# Altium schematic sheet MicroSd.SchDoc
size A4; SheetNumber: 2; SheetTotal: 3
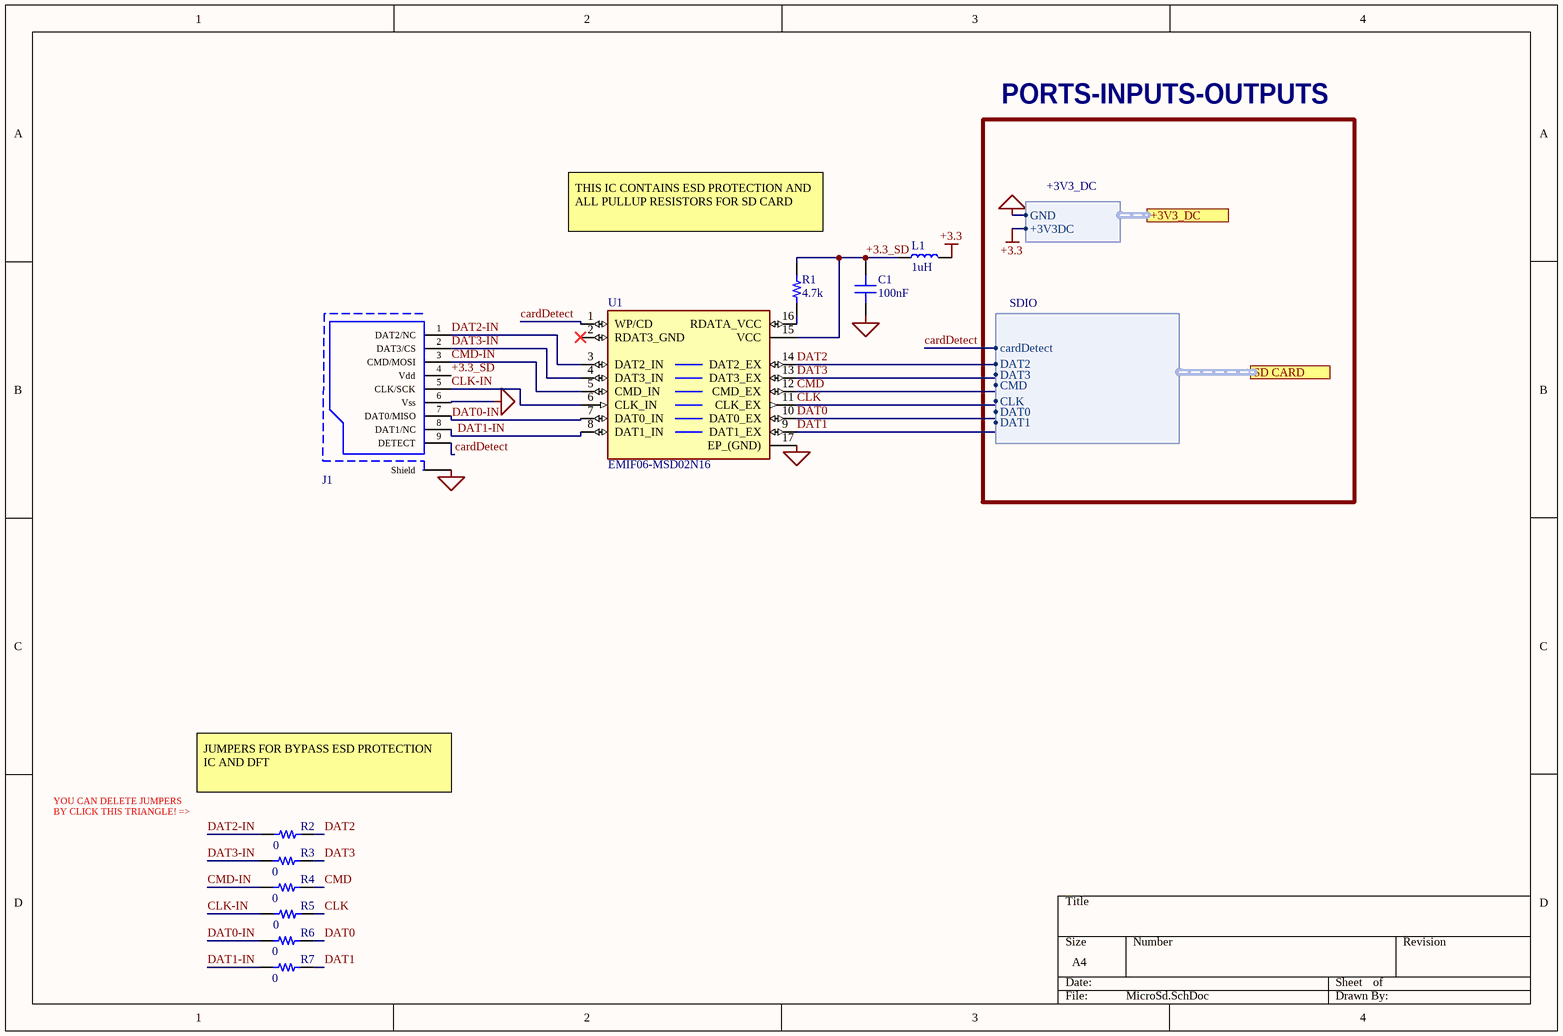
[diagram p0: MicroSd.SchDoc]

## Parts
C1  100nF  [CAP 0603_1608]
J1  Micro SD  [TFP-09-2-12B]  (value not drawn)
L1  1uH  [IND 0805_2012]
R1  4.7k  [RES 0603_1608]
R2  0  [RES 0805_2012]
R3  0  [RES 0805_2012]
R4  0  [RES 0805_2012]
R5  0  [RES 0805_2012]
R6  0  [RES 0805_2012]
R7  0  [RES 0805_2012]
U1  EMIF06-MSD02N16  [EMIF06MSD02N16]

## Ports
+3V3_DC (harness +3V3_DC, see Main[2B]), SD CARD (harness SDIO, see Main[2B])

## Harnesses
SDIO: DAT2, DAT3, CMD, CLK, DAT0, DAT1, cardDetect
+3V3_DC: +3V3DC, GND

## Nets
+3.3: L1.2 ; port +3V3_DC.+3V3DC
IGND: C1.1 J1.6(Vss) J1.10(Shield) U1.17(EP_(GND)) ; port +3V3_DC.GND
+3.3_SD: C1.2 J1.4(Vdd) L1.1 R1.2 U1.15(VCC)
cardDetect: J1.9(DETECT) U1.1(WP/CD) ; port SD CARD.cardDetect
CLK: R5.2 U1.11(CLK_EX) ; port SD CARD.CLK
CLK-IN: J1.5(CLK/SCK) R5.1 U1.6(CLK_IN)
CMD: R4.2 U1.12(CMD_EX) ; port SD CARD.CMD
CMD-IN: J1.3(CMD/MOSI) R4.1 U1.5(CMD_IN)
DAT0: R6.2 U1.10(DAT0_EX) ; port SD CARD.DAT0
DAT0-IN: J1.7(DAT0/MISO) R6.1 U1.7(DAT0_IN)
DAT1: R7.2 U1.9(DAT1_EX) ; port SD CARD.DAT1
DAT1-IN: J1.8(DAT1/NC) R7.1 U1.8(DAT1_IN)
DAT2: R2.2 U1.14(DAT2_EX) ; port SD CARD.DAT2
DAT2-IN: J1.1(DAT2/NC) R2.1 U1.3(DAT2_IN)
DAT3: R3.2 U1.13(DAT3_EX) ; port SD CARD.DAT3
DAT3-IN: J1.2(DAT3/CS) R3.1 U1.4(DAT3_IN)
NetR1_1: R1.1 U1.16(RDATA_VCC)

Not connected (* = marked no-connect by the designer): U1 2(RDAT3_GND)*

## Notes on the sheet
- PORTS-INPUTS-OUTPUTS
- THIS IC CONTAINS ESD PROTECTION AND ALL PULLUP RESISTORS FOR SD CARD
- (near R2) JUMPERS FOR BYPASS ESD PROTECTION IC AND DFT
- YOU CAN DELETE JUMPERS
- BY CLICK THIS TRIANGLE! =>

## Library data of the parts
C1 = Cap 0603: SMT Capacitor; VALUE: 100nF
J1 = Micro SD TFP-09-2-12B: PartNumber: TFP-09-2-12B
L1 = Ind 0805: SMT Inductor; Value: 1uH
R1 = Res 0603: SMT Resistor; VALUE: 1K
R2-R7 = Res 0805: SMT Resistor; VALUE: 1K
U1 = EMIF06-MSD02N16: RC (Pi) EMI Filter 2nd Order Low Pass 6 Channel R = 45Ohms, C = 20pF (Total) 16-UFDFN Exposed Pad; MF: STMicroelectronics; Value: *; Availability: Warning; Price: None; Package: UFDFN-16 STMicroelectronics; MP: EMIF06-MSD02N16; Purchase-URL: https://pricing.snapeda.com/search/part/EMIF06-MSD02N16/?ref=eda; SnapEDA_Link: https://www.snapeda.com/parts/EMIF06-MSD02N16/STMicroelectronics/view-part/274332/?ref=snap